# EAGLE design untitled (EAGLE 9.2.0)
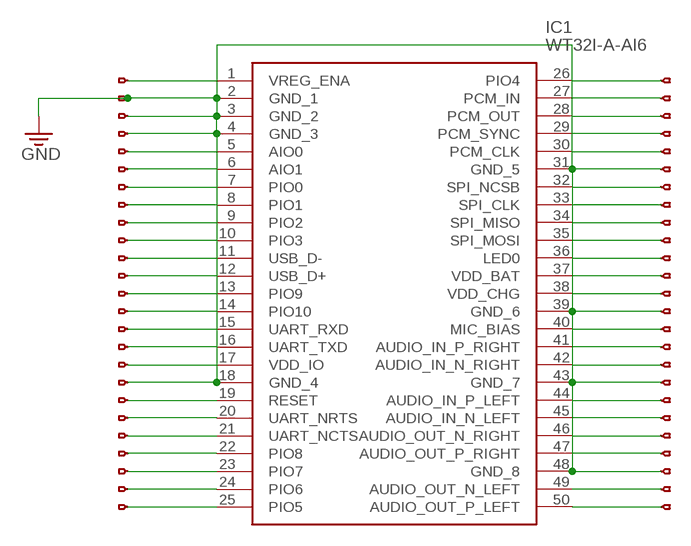
[diagram p0: schematic, sheet 1]

## Parts
IC1  WT32I-A-AI6  [WT32I-A-AI6]
JP1  HEADERHOLE-HEADERHOLE  [1X1-HEADER-HOLE]
JP2  HEADERHOLE-HEADERHOLE  [1X1-HEADER-HOLE]
JP3  HEADERHOLE-HEADERHOLE  [1X1-HEADER-HOLE]
JP4  HEADERHOLE-HEADERHOLE  [1X1-HEADER-HOLE]
JP5  HEADERHOLE-HEADERHOLE  [1X1-HEADER-HOLE]
JP6  HEADERHOLE-HEADERHOLE  [1X1-HEADER-HOLE]
JP7  HEADERHOLE-HEADERHOLE  [1X1-HEADER-HOLE]
JP8  HEADERHOLE-HEADERHOLE  [1X1-HEADER-HOLE]
JP9  HEADERHOLE-HEADERHOLE  [1X1-HEADER-HOLE]
JP10  HEADERHOLE-HEADERHOLE  [1X1-HEADER-HOLE]
JP11  HEADERHOLE-HEADERHOLE  [1X1-HEADER-HOLE]
JP12  HEADERHOLE-HEADERHOLE  [1X1-HEADER-HOLE]
JP13  HEADERHOLE-HEADERHOLE  [1X1-HEADER-HOLE]
JP14  HEADERHOLE-HEADERHOLE  [1X1-HEADER-HOLE]
JP15  HEADERHOLE-HEADERHOLE  [1X1-HEADER-HOLE]
JP16  HEADERHOLE-HEADERHOLE  [1X1-HEADER-HOLE]
JP17  HEADERHOLE-HEADERHOLE  [1X1-HEADER-HOLE]
JP18  HEADERHOLE-HEADERHOLE  [1X1-HEADER-HOLE]
JP19  HEADERHOLE-HEADERHOLE  [1X1-HEADER-HOLE]
JP20  HEADERHOLE-HEADERHOLE  [1X1-HEADER-HOLE]
JP21  HEADERHOLE-HEADERHOLE  [1X1-HEADER-HOLE]
JP22  HEADERHOLE-HEADERHOLE  [1X1-HEADER-HOLE]
JP23  HEADERHOLE-HEADERHOLE  [1X1-HEADER-HOLE]
JP24  HEADERHOLE-HEADERHOLE  [1X1-HEADER-HOLE]
JP25  HEADERHOLE-HEADERHOLE  [1X1-HEADER-HOLE]
JP26  HEADERHOLE-HEADERHOLE  [1X1-HEADER-HOLE]
JP27  HEADERHOLE-HEADERHOLE  [1X1-HEADER-HOLE]
JP28  HEADERHOLE-HEADERHOLE  [1X1-HEADER-HOLE]
JP29  HEADERHOLE-HEADERHOLE  [1X1-HEADER-HOLE]
JP30  HEADERHOLE-HEADERHOLE  [1X1-HEADER-HOLE]
JP31  HEADERHOLE-HEADERHOLE  [1X1-HEADER-HOLE]
JP32  HEADERHOLE-HEADERHOLE  [1X1-HEADER-HOLE]
JP33  HEADERHOLE-HEADERHOLE  [1X1-HEADER-HOLE]
JP34  HEADERHOLE-HEADERHOLE  [1X1-HEADER-HOLE]
JP35  HEADERHOLE-HEADERHOLE  [1X1-HEADER-HOLE]
JP36  HEADERHOLE-HEADERHOLE  [1X1-HEADER-HOLE]
JP37  HEADERHOLE-HEADERHOLE  [1X1-HEADER-HOLE]
JP38  HEADERHOLE-HEADERHOLE  [1X1-HEADER-HOLE]
JP39  HEADERHOLE-HEADERHOLE  [1X1-HEADER-HOLE]
JP40  HEADERHOLE-HEADERHOLE  [1X1-HEADER-HOLE]
JP41  HEADERHOLE-HEADERHOLE  [1X1-HEADER-HOLE]
JP42  HEADERHOLE-HEADERHOLE  [1X1-HEADER-HOLE]
JP43  HEADERHOLE-HEADERHOLE  [1X1-HEADER-HOLE]
JP44  HEADERHOLE-HEADERHOLE  [1X1-HEADER-HOLE]
JP45  HEADERHOLE-HEADERHOLE  [1X1-HEADER-HOLE]
JP46  HEADERHOLE-HEADERHOLE  [1X1-HEADER-HOLE]
JP47  HEADERHOLE-HEADERHOLE  [1X1-HEADER-HOLE]
JP48  HEADERHOLE-HEADERHOLE  [1X1-HEADER-HOLE]
JP49  HEADERHOLE-HEADERHOLE  [1X1-HEADER-HOLE]
JP50  HEADERHOLE-HEADERHOLE  [1X1-HEADER-HOLE]

## Nets
GND: IC1.2(GND_1) IC1.3(GND_2) IC1.4(GND_3) IC1.18(GND_4) IC1.31(GND_5) IC1.39(GND_6) IC1.43(GND_7) IC1.48(GND_8) JP2.1 JP3.1 JP4.1 JP18.1 JP31.1 JP39.1 JP43.1 JP48.1
N$1: IC1.1(VREG_ENA) JP1.1
N$5: IC1.5(AIO0) JP5.1
N$6: IC1.6(AIO1) JP6.1
N$7: IC1.7(PIO0) JP7.1
N$8: IC1.8(PIO1) JP8.1
N$9: IC1.9(PIO2) JP9.1
N$10: IC1.10(PIO3) JP10.1
N$11: IC1.11(USB_D-) JP11.1
N$12: IC1.12(USB_D+) JP12.1
N$13: IC1.13(PIO9) JP13.1
N$14: IC1.14(PIO10) JP14.1
N$15: IC1.15(UART_RXD) JP15.1
N$16: IC1.16(UART_TXD) JP16.1
N$17: IC1.17(VDD_IO) JP17.1
N$19: IC1.19(RESET) JP19.1
N$20: IC1.20(UART_NRTS) JP20.1
N$21: IC1.21(UART_NCTS) JP21.1
N$22: IC1.22(PIO8) JP22.1
N$23: IC1.23(PIO7) JP23.1
N$24: IC1.24(PIO6) JP24.1
N$25: IC1.25(PIO5) JP25.1
N$26: IC1.26(PIO4) JP26.1
N$27: IC1.27(PCM_IN) JP27.1
N$28: IC1.28(PCM_OUT) JP28.1
N$29: IC1.29(PCM_SYNC) JP29.1
N$30: IC1.30(PCM_CLK) JP30.1
N$32: IC1.32(SPI_NCSB) JP32.1
N$33: IC1.33(SPI_CLK) JP33.1
N$34: IC1.34(SPI_MISO) JP34.1
N$35: IC1.35(SPI_MOSI) JP35.1
N$36: IC1.36(LED0) JP36.1
N$37: IC1.37(VDD_BAT) JP37.1
N$38: IC1.38(VDD_CHG) JP38.1
N$40: IC1.40(MIC_BIAS) JP40.1
N$41: IC1.41(AUDIO_IN_P_RIGHT) JP41.1
N$42: IC1.42(AUDIO_IN_N_RIGHT) JP42.1
N$44: IC1.44(AUDIO_IN_P_LEFT) JP44.1
N$45: IC1.45(AUDIO_IN_N_LEFT) JP45.1
N$46: IC1.46(AUDIO_OUT_N_RIGHT) JP46.1
N$47: IC1.47(AUDIO_OUT_P_RIGHT) JP47.1
N$49: IC1.49(AUDIO_OUT_N_LEFT) JP49.1
N$50: IC1.50(AUDIO_OUT_P_LEFT) JP50.1

## Library data of the parts
IC1 = WT32i-A-AI6:WT32I-A-AI6: Bluetooth / 802.15.1 Modules Class1 BT 3.0, Audio Module, Int Ant Source: Datasheet <http://www.mouser.com/ds/2/368/Bluegigga Technologies_WT32i_Datasheet-558681.pdf>; DESCRIPTION: Bluetooth / 802.15.1 Modules Class1 BT 3.0, Audio Module, Int Ant; HEIGHT: mm; MANUFACTURER_NAME: Silicon Labs; MANUFACTURER_PART_NUMBER: WT32i-A-AI6; MOUSER_PART_NUMBER: 603-WT32I-A-AI6; MOUSER_PRICE-STOCK: https://www.mouser.com/Search/Refine.aspx?Keyword=603-WT32I-A-AI6
JP1-JP50 = F405Pill:HEADERHOLE

## Board
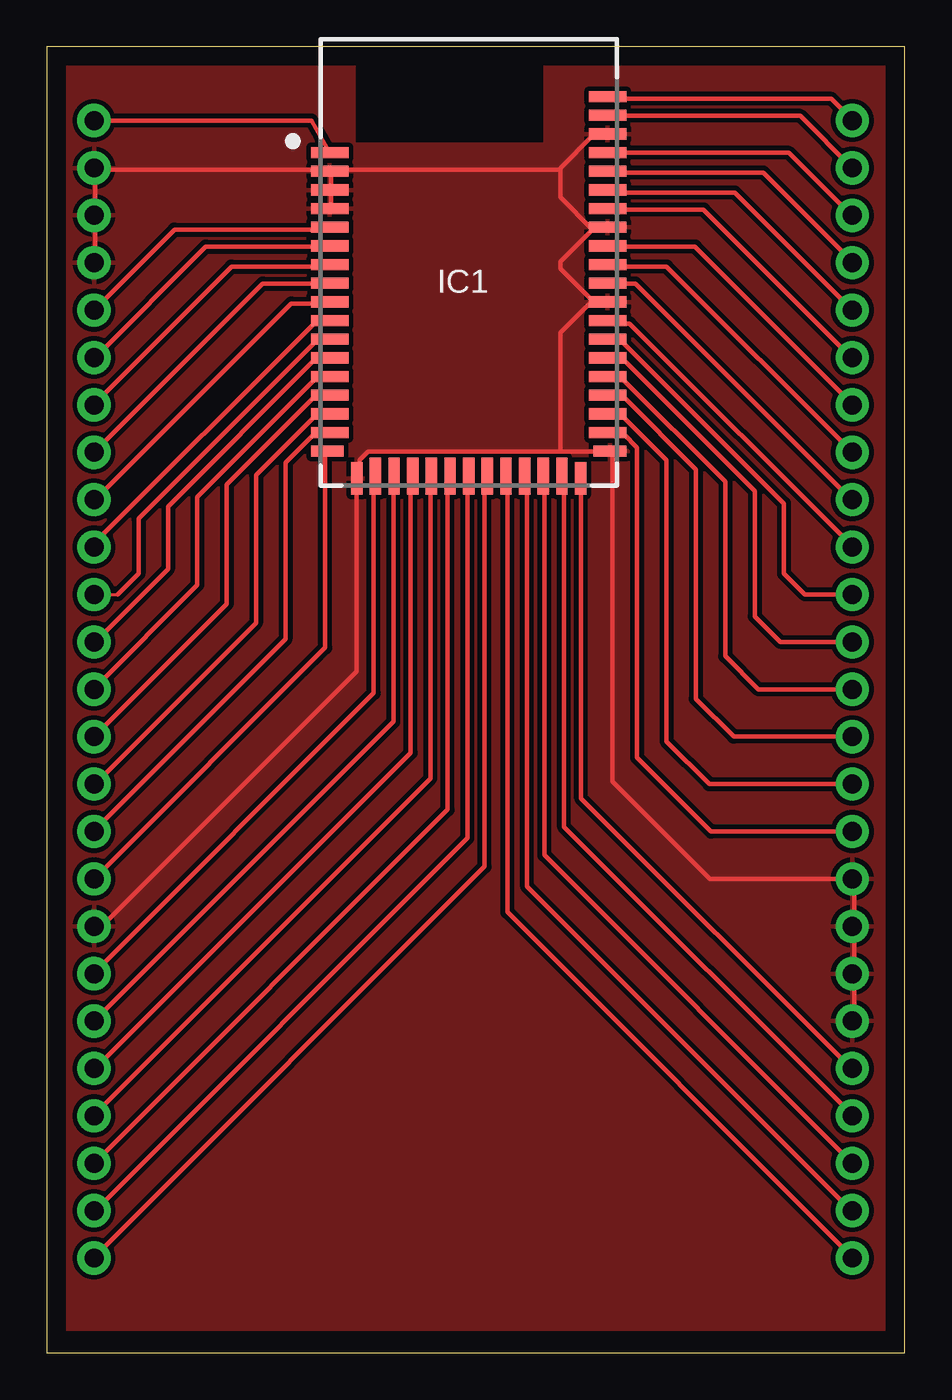
[diagram p1: board, top side]

Size 46 x 70 mm. Coordinates in mm from the lower left corner, seen from the top.
Outline: 0,0 46,0 46,70 0,70 0,0
Copper layers (1*16): Top 0.035mm / dielectric 1.5mm / Bottom 0.035mm
Design rules "default": minimum track width 6mil, minimum drill 0.35mm, track to track 6mil, track to pad 6mil, pad to pad 6mil, via to via 6mil, smd to smd 6mil, copper to edge 40mil, drill to drill 6mil, minimum pad ring 10mil, minimum via ring 8mil, stop-mask expansion 4mil, vias tented up to drill 0mil, thermal gap 10mil

### Footprints (pad centres in the part's own frame; a part is rotated, then mirrored left to right if it is on the bottom)
WT32I-A-AI6 = smd 2 x 0.6: 1 -7.45,17.33; 2 -7.45,16.33; 3 -7.45,15.33; 4 -7.45,14.33; 5 -7.45,13.33; 6 -7.45,12.33; 7 -7.45,11.33; 8 -7.45,10.33; 9 -7.45,9.33; 10 -7.45,8.33; 11 -7.45,7.33; 12 -7.45,6.33; 13 -7.45,5.33; 14 -7.45,4.33; 15 -7.45,3.33; 16 -7.45,2.33; 32 7.45,2.33; 33 7.45,3.33; 34 7.45,4.33; 35 7.45,5.33; 36 7.45,6.33; 37 7.45,7.33; 38 7.45,8.33; 39 7.45,9.33; 40 7.45,10.33; 41 7.45,11.33; 42 7.45,12.33; 43 7.45,13.33; 44 7.45,14.33; 45 7.45,15.33; 46 7.45,16.33; 47 7.45,17.33; 48 7.45,18.33; 49 7.45,19.33; 50 7.45,20.33 | smd 1.75 x 0.6: 17 -7.575,1.33; 31 7.575,1.33 | smd 0.6 x 1.75: 18 -6,-0.125; 30 6,-0.125 | smd 0.6 x 2: 19 -5,0; 20 -4,0; 21 -3,0; 22 -2,0; 23 -1,0; 24 0,0; 25 1,0; 26 2,0; 27 3,0; 28 4,0; 29 5,0
1X1-HEADER-HOLE = drill 1.016 pad 1.778: 1 0,0

### Placement (x,y rotation side)
IC1  22.62,46.99 0 top
JP1  2.54,66.04 0 top
JP2  2.54,63.5 0 top
JP3  2.54,60.96 0 top
JP4  2.54,58.42 0 top
JP5  2.54,55.88 0 top
JP6  2.54,53.34 0 top
JP7  2.54,50.8 0 top
JP8  2.54,48.26 0 top
JP9  2.54,45.72 0 top
JP10  2.54,43.18 0 top
JP11  2.54,40.64 0 top
JP12  2.54,38.1 0 top
JP13  2.54,35.56 0 top
JP14  2.54,33.02 0 top
JP15  2.54,30.48 0 top
JP16  2.54,27.94 0 top
JP17  2.54,25.4 0 top
JP18  2.54,22.86 0 top
JP19  2.54,20.32 0 top
JP20  2.54,17.78 0 top
JP21  2.54,15.24 0 top
JP22  2.54,12.7 0 top
JP23  2.54,10.16 0 top
JP24  2.54,7.62 0 top
JP25  2.54,5.08 0 top
JP26  43.18,5.08 0 top
JP27  43.18,7.62 0 top
JP28  43.18,10.16 0 top
JP29  43.18,12.7 0 top
JP30  43.18,15.24 0 top
JP31  43.18,25.4 0 top
JP32  43.18,27.94 0 top
JP33  43.18,30.48 0 top
JP34  43.18,33.02 0 top
JP35  43.18,35.56 0 top
JP36  43.18,38.1 0 top
JP37  43.18,40.64 0 top
JP38  43.18,43.18 0 top
JP39  43.18,22.86 0 top
JP40  43.18,45.72 0 top
JP41  43.18,48.26 0 top
JP42  43.18,50.8 0 top
JP43  43.18,17.78 0 top
JP44  43.18,53.34 0 top
JP45  43.18,55.88 0 top
JP46  43.18,58.42 0 top
JP47  43.18,60.96 0 top
JP48  43.18,20.32 0 top
JP49  43.18,63.5 0 top
JP50  43.18,66.04 0 top

### Tracks (layer width: path | path; a pad name or v marks a point on that pad's centre or on a via)
GND
  Top 0.152: 2.59,58.52 JP4.1 | 15.24,61.42 IC1.4 | 15.24,62.18 IC1.3 15.24,62.33 | 15.24,63.25 IC1.2 | 15.09,63.4 IC1.2 | 2.59,60.96 JP3.1 | 2.59,63.4 JP2.1 | 43.28,17.83 JP43.1 | 43.28,20.27 JP48.1 43.28,20.42 | 43.28,25.3 JP31.1 | 43.28,22.86 JP39.1 | 29.26,65.23 30.02,65.23 IC1.48 | 16.76,46.94 IC1.18 16.61,46.79 | 30.18,48.31 IC1.31 30.33,48.31 | JP18.1 2.95,22.86 | 15.24,63.4 IC1.2 | 29.26,56.39 30.02,56.39 IC1.39 29.26,56.39 | 30.02,60.2 29.26,60.2 IC1.43 30.02,60.2
  Top 0.254: 2.59,58.52 2.59,60.96 2.59,63.4 15.09,63.4 | 15.24,62.18 15.24,61.42 | 15.24,62.33 15.24,63.25 | 43.28,20.27 43.28,17.83 | 43.28,25.3 43.28,22.86 43.28,20.42 | 29.26,65.23 27.53,63.5 27.53,63.4 | 27.53,63.4 27.53,61.92 29.26,60.2 27.53,58.47 27.53,58.12 29.26,56.39 27.53,54.66 27.53,48.31 | 16.76,46.94 16.76,47.85 17.22,48.31 27.53,48.31 | 30.18,48.31 27.53,48.31 | 2.95,22.86 16.61,36.52 16.61,46.79 | JP31.1 35.56,25.4 30.33,30.63 30.33,48.31 | 27.53,63.4 15.24,63.4
  pour Top (isolate 0.254): 0,69.85 0,1.27 45.72,1.27 45.72,69.85 26.67,69.85 26.67,64.77 16.51,64.77 16.51,69.85
N$1
  Top 0.254: JP1.1 14.19,66.04 IC1.1
N$5
  Top 0.152: 15.09,60.2 IC1.5
  Top 0.254: 15.09,60.2 6.86,60.2 JP5.1
N$6
  Top 0.152: 15.09,59.28 IC1.6 | 2.59,53.34 JP6.1
  Top 0.254: 15.09,59.28 8.53,59.28 2.59,53.34
N$7
  Top 0.152: 15.09,58.22 IC1.7 | 2.59,50.9 JP7.1
  Top 0.254: 15.09,58.22 9.91,58.22 2.59,50.9
N$8
  Top 0.152: 15.09,57.3 IC1.8
  Top 0.254: 15.09,57.3 11.58,57.3 JP8.1
N$9
  Top 0.152: 15.09,56.24 IC1.9 | 2.59,45.72 JP9.1
  Top 0.254: 15.09,56.24 13.11,56.24 2.59,45.72
N$10
  Top 0.152: 15.09,55.17 IC1.10 | 2.44,43.28 JP10.1
  Top 0.254: 15.09,55.17 14.33,55.17 2.44,43.28
N$11
  Top 0.152: JP11.1 3.81,40.64 | 15.09,54.25 IC1.11
  Top 0.254: 15.09,54.25 14.48,54.25 4.93,44.7 4.93,41.76 3.81,40.64
N$12
  Top 0.152: 15.09,53.19 IC1.12 | 2.59,38.1 JP12.1
  Top 0.254: 15.09,53.19 14.33,53.19 6.5,45.36 6.5,42.01 2.59,38.1
N$13
  Top 0.152: 15.09,52.27 IC1.13 | 2.59,35.66 JP13.1
  Top 0.254: 15.09,52.27 14.48,52.27 8.08,45.87 8.08,41.15 2.59,35.66
N$14
  Top 0.152: 15.09,51.21 IC1.14
  Top 0.254: 15.09,51.21 14.33,51.21 9.65,46.53 9.65,40.13 JP14.1
N$15
  Top 0.152: 15.09,50.29 IC1.15 | 2.59,30.48 JP15.1
  Top 0.254: 15.09,50.29 14.48,50.29 11.23,47.04 11.23,39.12 2.59,30.48
N$16
  Top 0.152: 15.09,49.23 IC1.16 | 2.59,28.04 JP16.1
  Top 0.254: 15.09,49.23 14.33,49.23 12.8,47.7 12.8,38.25 2.59,28.04
N$17
  Top 0.152: 14.94,48.31 IC1.17
  Top 0.254: 14.94,48.31 14.94,37.8 JP17.1
N$19
  Top 0.152: 17.53,46.94 IC1.19 | 2.59,20.42 JP19.1
  Top 0.254: 17.53,46.94 17.53,35.36 2.59,20.42
N$20
  Top 0.152: 18.59,46.94 IC1.20
  Top 0.254: 18.59,46.94 18.59,33.83 JP20.1
N$21
  Top 0.152: 19.51,46.94 IC1.21 | 2.59,15.24 JP21.1
  Top 0.254: 19.51,46.94 19.51,32.16 2.59,15.24
N$22
  Top 0.152: 20.57,46.94 IC1.22 | 2.59,12.8 JP22.1
  Top 0.254: 20.57,46.94 20.57,30.79 2.59,12.8
N$23
  Top 0.152: 21.49,46.94 IC1.23
  Top 0.254: 21.49,46.94 21.49,29.11 JP23.1
N$24
  Top 0.152: 22.55,46.94 IC1.24 | 2.59,7.62 JP24.1
  Top 0.254: 22.55,46.94 22.55,27.58 2.59,7.62
N$25
  Top 0.152: 23.47,46.94 IC1.25 | 2.59,5.18 JP25.1
  Top 0.254: 23.47,46.94 23.47,26.06 2.59,5.18
N$26
  Top 0.152: 24.69,46.94 IC1.26 | 43.13,5.18 JP26.1
  Top 0.254: 24.69,46.94 24.69,23.62 43.13,5.18
N$27
  Top 0.152: 25.76,46.94 IC1.27 | 43.13,7.62 JP27.1
  Top 0.254: 25.76,46.94 25.76,24.99 43.13,7.62
N$28
  Top 0.152: 26.67,46.94 IC1.28
  Top 0.254: 26.67,46.94 26.67,26.67 JP28.1
N$29
  Top 0.152: 27.74,46.94 IC1.29 | 43.13,12.8 JP29.1
  Top 0.254: 27.74,46.94 27.74,28.19 43.13,12.8
N$30
  Top 0.152: 28.65,46.79 IC1.30 | 43.13,15.24 JP30.1
  Top 0.254: 28.65,46.79 28.65,29.72 43.13,15.24
N$32
  Top 0.152: 30.94,49.23 30.18,49.23 IC1.32
  Top 0.254: 30.94,49.23 31.65,48.51 31.65,31.9 35.61,27.94 JP32.1
N$33
  Top 0.152: 30.18,50.29 IC1.33
  Top 0.254: 30.18,50.29 30.79,50.29 33.22,47.85 33.22,32.77 35.51,30.48 JP33.1
N$34
  Top 0.152: 30.18,51.21 IC1.34
  Top 0.254: 30.18,51.21 30.94,51.21 34.8,47.35 34.8,35.05 36.83,33.02 JP34.1
N$35
  Top 0.152: 30.79,52.27 30.18,52.27 IC1.35
  Top 0.254: 30.79,52.27 36.37,46.69 36.37,37.34 38.15,35.56 JP35.1
N$36
  Top 0.152: 30.18,53.19 IC1.36
  Top 0.254: 30.18,53.19 30.94,53.19 37.95,46.18 37.95,39.47 39.32,38.1 JP36.1
N$37
  Top 0.152: 30.18,54.25 IC1.37
  Top 0.254: 30.18,54.25 30.79,54.25 39.52,45.52 39.52,41.76 40.64,40.64 JP37.1
N$38
  Top 0.152: 30.18,55.17 IC1.38 | 43.13,43.28 JP38.1
  Top 0.254: 30.18,55.17 31.24,55.17 43.13,43.28
N$40
  Top 0.152: 30.18,57.3 IC1.40 | 43.13,45.72 JP40.1
  Top 0.254: 30.18,57.3 31.55,57.3 43.13,45.72
N$41
  Top 0.152: 30.18,58.22 IC1.41
  Top 0.254: 30.18,58.22 33.22,58.22 JP41.1
N$42
  Top 0.152: 30.18,59.28 IC1.42 | 43.13,50.9 JP42.1
  Top 0.254: 30.18,59.28 34.75,59.28 43.13,50.9
N$44
  Top 0.152: 30.18,61.27 IC1.44 | 43.13,53.34 JP44.1
  Top 0.254: 30.18,61.27 35.2,61.27 43.13,53.34
N$45
  Top 0.152: 30.18,62.18 IC1.45
  Top 0.254: 30.18,62.18 36.88,62.18 JP45.1
N$46
  Top 0.152: 30.18,63.25 IC1.46 | 43.13,58.52 JP46.1
  Top 0.254: 30.18,63.25 38.41,63.25 43.13,58.52
N$47
  Top 0.152: 30.18,64.31 IC1.47 | 43.13,60.96 JP47.1
  Top 0.254: 30.18,64.31 39.78,64.31 43.13,60.96
N$49
  Top 0.152: 30.18,66.29 IC1.49
  Top 0.254: 30.18,66.29 40.39,66.29 JP49.1
N$50
  Top 0.152: 30.18,67.21 IC1.50 | 43.13,66.14 JP50.1
  Top 0.254: 30.18,67.21 42.06,67.21 43.13,66.14